# EAGLE schematic dynalo_v_dual (EAGLE 7.4.0)
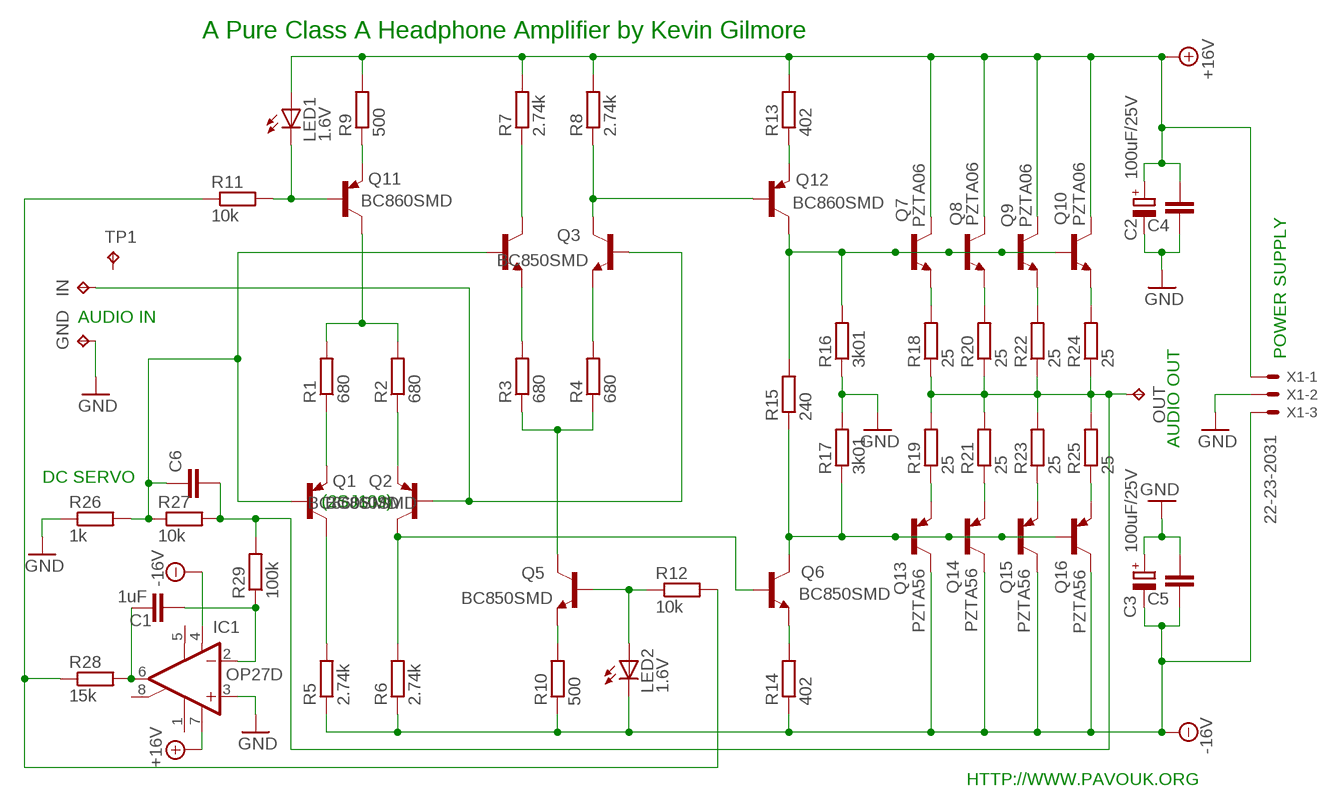
[diagram p0: schematic, sheet 1]

## Parts
C1  1uF  C-EUC1206  [C1206]
C2  100uF/25V  CPOL-EUE3.5-8  [E3,5-8]
C3  100uF/25V  CPOL-EUE3.5-8  [E3,5-8]
C4  C-EUC1206  [C1206]
C5  C-EUC1206  [C1206]
C6  C-EUC1206  [C1206]
GND  TPPAD1-13  [P1-13]
IC1  OP27D  [SO08]
IN  TPPAD1-13  [P1-13]
LED1  1.6V  LEDCHIPLED_1206  [CHIPLED_1206]
LED2  1.6V  LEDCHIPLED_1206  [CHIPLED_1206]
OUT  TPPAD1-13  [P1-13]
Q1  BC860SMD  BC860CSMD  [SOT23-BEC]
Q2  BC860SMD  BC860CSMD  [SOT23-BEC]
Q3  BC850SMD  [SOT23-BEC]
Q4  BC850SMD  [SOT23-BEC]
Q5  BC850SMD  [SOT23-BEC]
Q6  BC850SMD  [SOT23-BEC]
Q7  PZTA06  [SOT223R_INFINEON]
Q8  PZTA06  [SOT223R_INFINEON]
Q9  PZTA06  [SOT223R_INFINEON]
Q10  PZTA06  [SOT223R_INFINEON]
Q11  BC860SMD  BC860CSMD  [SOT23-BEC]
Q12  BC860SMD  BC860CSMD  [SOT23-BEC]
Q13  PZTA56  [SOT223R_INFINEON]
Q14  PZTA56  [SOT223R_INFINEON]
Q15  PZTA56  [SOT223R_INFINEON]
Q16  PZTA56  [SOT223R_INFINEON]
R1  680  R-EU_MELF0204W  [MINI_MELF-0204W]
R2  680  R-EU_MELF0204W  [MINI_MELF-0204W]
R3  680  R-EU_MELF0204W  [MINI_MELF-0204W]
R4  680  R-EU_MELF0204W  [MINI_MELF-0204W]
R5  2.74k  R-EU_MELF0204W  [MINI_MELF-0204W]
R6  2.74k  R-EU_MELF0204W  [MINI_MELF-0204W]
R7  2.74k  R-EU_MELF0204W  [MINI_MELF-0204W]
R8  2.74k  R-EU_MELF0204W  [MINI_MELF-0204W]
R9  500  R-EU_MELF0204W  [MINI_MELF-0204W]
R10  500  R-EU_MELF0204W  [MINI_MELF-0204W]
R11  10k  R-EU_MELF0204W  [MINI_MELF-0204W]
R12  10k  R-EU_MELF0204W  [MINI_MELF-0204W]
R13  402  R-EU_MELF0204W  [MINI_MELF-0204W]
R14  402  R-EU_MELF0204W  [MINI_MELF-0204W]
R15  240  R-EU_MELF0204W  [MINI_MELF-0204W]
R16  3k01  R-EU_MELF0204W  [MINI_MELF-0204W]
R17  3k01  R-EU_MELF0204W  [MINI_MELF-0204W]
R18  25  R-EU_MELF0204W  [MINI_MELF-0204W]
R19  25  R-EU_MELF0204W  [MINI_MELF-0204W]
R20  25  R-EU_MELF0204W  [MINI_MELF-0204W]
R21  25  R-EU_MELF0204W  [MINI_MELF-0204W]
R22  25  R-EU_MELF0204W  [MINI_MELF-0204W]
R23  25  R-EU_MELF0204W  [MINI_MELF-0204W]
R24  25  R-EU_MELF0204W  [MINI_MELF-0204W]
R25  25  R-EU_MELF0204W  [MINI_MELF-0204W]
R26  1k  R-EU_MELF0204W  [MINI_MELF-0204W]
R27  10k  R-EU_MELF0204W  [MINI_MELF-0204W]
R28  15k  R-EU_MELF0204W  [MINI_MELF-0204W]
R29  100k  R-EU_MELF0204W  [MINI_MELF-0204W]
TP1  TPPAD1-13  [P1-13]
X1  22-23-2031  [22-23-2031]

## Nets
+15V: C2.+ C4.2 IC1.7(V+) LED1.A Q7.2(C) Q7.4(C) Q8.2(C) Q8.4(C) Q9.2(C) Q9.4(C) Q10.2(C) Q10.4(C) R7.2 R8.2 R9.2 R13.2 X1.1 ; supply symbol labelled +16V
-15V: C3.- C5.1 IC1.4(V-) LED2.C Q13.2(C) Q13.4(C) Q14.2(C) Q14.4(C) Q15.2(C) Q15.4(C) Q16.2(C) Q16.4(C) R5.1 R6.1 R10.1 R14.1 X1.3 ; supply symbol labelled -16V
GND: C2.- C3.+ C4.1 C5.2 GND.TP IC1.3(+IN) R16.1 R17.2 R26.1 X1.2
N$1: C6.2 OUT.TP R18.1 R19.2 R20.1 R21.2 R22.1 R23.2 R24.1 R25.2 R27.2 R29.2
N$2: Q7.3(E) R18.2
N$3: Q8.3(E) R20.2
N$4: Q9.3(E) R22.2
N$5: Q10.3(E) R24.2
N$6: Q13.3(E) R19.1
N$7: Q14.3(E) R21.1
N$8: Q15.3(E) R23.1
N$9: Q16.3(E) R25.1
N$10: Q11.E R9.1
N$11: Q7.1(B) Q8.1(B) Q9.1(B) Q10.1(B) Q12.C R15.2 R16.2
N$12: LED1.C Q11.B R11.2
N$13: Q6.C Q13.1(B) Q14.1(B) Q15.1(B) Q16.1(B) R15.1 R17.1
N$14: Q12.E R13.1
N$15: Q6.E R14.2
N$16: Q5.E R10.2
N$17: LED2.A Q5.B R12.1
N$18: Q5.C R3.1 R4.1
N$19: Q4.C R7.1
N$20: Q4.E R3.2
N$21: Q3.E R4.2
N$22: Q3.C Q12.B R8.1
N$23: Q1.E R1.1
N$24: Q2.C Q6.B R6.2
N$25: Q2.E R2.1
N$26: Q1.C R5.2
N$27: Q11.C R1.2 R2.2
N$28: C6.1 Q1.B Q4.B R26.2 R27.1
N$29: IN.TP Q2.B Q3.B
N$30: C1.1 IC1.6(OUT) R28.2
N$32: C1.2 IC1.2(-IN) R29.1
N$34: R11.1 R12.2 R28.1
Unconnected: IC1.1(ON1) IC1.5(OPT) IC1.8(ON2) TP1.TP

## Notes on the sheet
- A Pure Class A Headphone Amplifier by Kevin Gilmore
- AUDIO IN
- POWER SUPPLY
- AUDIO OUT
- DC SERVO
- (2SJ109)
- HTTP://WWW.PAVOUK.ORG

## Library data of the parts
C1 C4-C6 = Vwvwbg:C-EU: CAPACITOR, European symbol
C2 C3 = rcl:CPOL-EU: POLARIZED CAPACITOR, European symbol
GND IN OUT TP1 = testpad:TP: Test pad
IC1 = linear:OP27: OP AMP
LED1 LED2 = led:LED: LED OSRAM: - CHIPLED LG R971, LG N971, LY N971, LG Q971, LY Q971, LO R971, LY R971 LH N974, LH R974 LS Q976, LO Q976, LY Q976 LO Q996 - Hyper CHIPLED LW Q18S LB Q993, LB Q99A, LB R99A - SideLED LS A670, LO A670, LY A670, LG A670, LP A670 LB A673, LV A673, LT A673, LW A673 LH A674 LY A675 LS A676, LA A676, LO A676, LY A676, LW A676 LS A679, LY A679, LG A679 - Hyper Micro SIDELED® LS Y876, LA Y876, LO Y876, LY Y876 LT Y87S - SmartLED LW L88C, LW L88S LB L89C, LB L89S, LG L890 LS L89K, LO L89K, LY L89K LS L896, LA L896, LO L896, LY L896 - TOPLED LS T670, LO T670, LY T670, LG T670, LP T670 LSG T670, LSP T670, LSY T670, LOP T670, LYG T670 LG T671, LOG T671, LSG T671 LB T673, LV T673, LT T673, LW T673 LH T674 LS T676, LA T676, LO T676, LY T676, LB T676, LH T676, LSB T676, LW T676 LB T67C, LV T67C, LT T67C, LS T67K, LO T67K, LY T67K, LW E67C LS E67B, LA E67B, LO E67B, LY E67B, LB E67C, LV E67C, LT E67C LW T67C LS T679, LY T679, LG T679 LS T770, LO T770, LY T770, LG T770, LP T770 LB T773, LV T773, LT T773, LW T773 LH T774 LS E675, LA E675, LY E675, LS T675 LS T776, LA T776, LO T776, LY T776, LB T776 LHGB T686 LT T68C, LB T68C - Hyper Mini TOPLED® LB M676 - Mini TOPLED Santana® LG M470 LS M47K, LO M47K, LY M47K Source: http://www.osram.convergy.de LUXEON: - LUMILED® LXK2-PW12-R00, LXK2-PW12-S00, LXK2-PW14-U00, LXK2-PW14-V00 LXK2-PM12-R00, LXK2-PM12-S00, LXK2-PM14-U00 LXK2-PE12-Q00, LXK2-PE12-R00, LXK2-PE12-S00, LXK2-PE14-T00, LXK2-PE14-U00 LXK2-PB12-K00, LXK2-PB12-L00, LXK2-PB12-M00, LXK2-PB14-N00, LXK2-PB14-P00, LXK2-PB14-Q00 LXK2-PR12-L00, LXK2-PR12-M00, LXK2-PR14-Q00, LXK2-PR14-R00 LXK2-PD12-Q00, LXK2-PD12-R00, LXK2-PD12-S00 LXK2-PH12-R00, LXK2-PH12-S00 LXK2-PL12-P00, LXK2-PL12-Q00, LXK2-PL12-R00 Source: www.luxeon.com KINGBRIGHT: KA-3528ASYC Source: www.kingbright.com
Q1 Q2 Q11 Q12 = tranzistory SMD PNP:BC860*: PNP Transistror
Q3-Q6 = tranzistory SMD NPN:BC850*: NPN Transistor
Q7-Q10 = tranzistory SMD NPN:PZTA06
Q13-Q16 = tranzistory SMD PNP:PZTA56
R1-R29 = Vwvwbg:R-EU_: RESISTOR, European symbol
X1 = con-molex:22-23-2031: .100" (2.54mm) Center Header - 3 Pin